# Altium schematic sheet S7CAS-PLEIADES-CARTE-MERE_P20_Passive-Components.SchDoc
size Tabloid; SheetNumber: 20; SheetTotal: 20; Sheet_Name: Insert name in Document Parameters; Size: 11x17
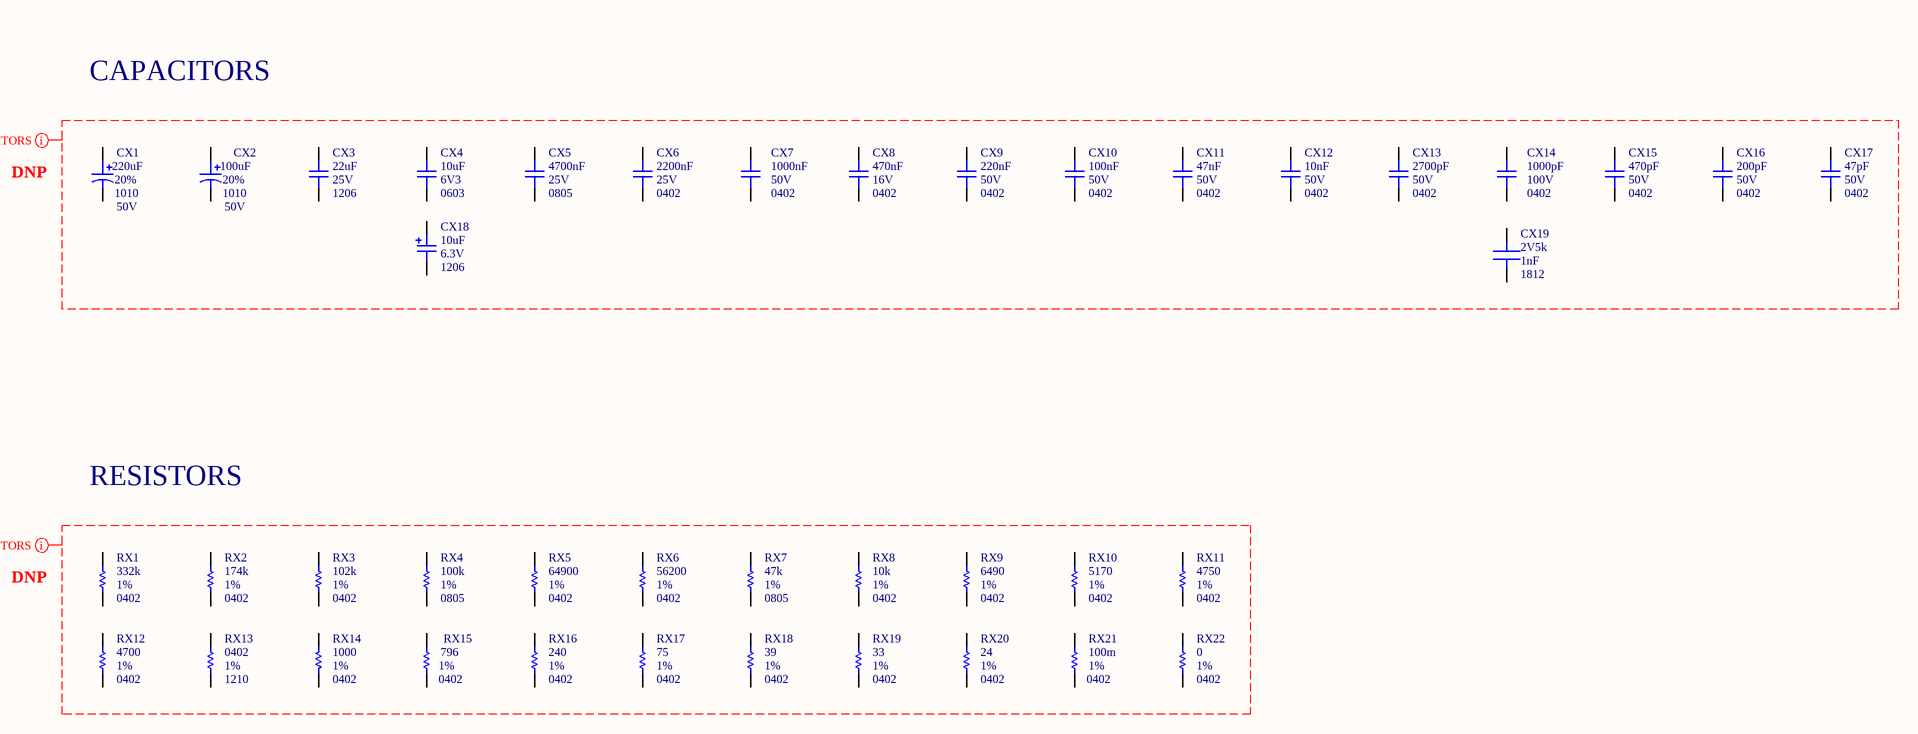
[diagram p0: S7CAS-PLEIADES-CARTE-MERE_P20_Passive-Components.SchDoc]

## Parts
CX1  value 220uF  Voltage: 50V  Package: 1010  Precision: 20%  [CAP_ALU_1010_vishay]  (hidden comment: MAL215099101E3)
CX2  value 100uF  Voltage: 50V  Package: 1010  Precision: 20%  [CAP_ALU_1010_vishay]  (hidden comment: MAL215099101E3)
CX3  value 22uF  Voltage: 25V  Package: 1206  [CAP_1206]  (hidden comment: CAP - 1206)
CX4  value 10uF  Voltage: 6V3  Package: 0603  [CAP_0603]  (hidden comment: CAP - 0603)
CX5  value 4700nF  Voltage: 25V  Package: 0805  [CAP_0805]  (hidden comment: CAP - 0805)
CX6  value 2200nF  Voltage: 25V  Package: 0402  [CAP_0402]  (hidden comment: CAP - 0402)
CX7  value 1000nF  Voltage: 50V  Package: 0402  [CAP_0402]  (hidden comment: CAP - 0402)
CX8  value 470nF  Voltage: 16V  Package: 0402  [CAP_0402]  (hidden comment: CAP - 0402)
CX9  value 220nF  Voltage: 50V  Package: 0402  [CAP_0402]  (hidden comment: CAP - 0402)
CX10  value 100nF  Voltage: 50V  Package: 0402  [CAP_0402]  (hidden comment: CAP - 0402)
CX11  value 47nF  Voltage: 50V  Package: 0402  [CAP_0402]  (hidden comment: CAP - 0402)
CX12  value 10nF  Voltage: 50V  Package: 0402  [CAP_0402]  (hidden comment: CAP - 0402)
CX13  value 2700pF  Voltage: 50V  Package: 0402  [CAP_0402]  (hidden comment: CAP - 0402)
CX14  value 1000pF  Voltage: 100V  Package: 0402  [CAP_0402]  (hidden comment: CAP - 0402)
CX15  value 470pF  Voltage: 50V  Package: 0402  [CAP_0402]  (hidden comment: CAP - 0402)
CX16  value 200pF  Voltage: 50V  Package: 0402  [CAP_0402]  (hidden comment: CAP - 0402)
CX17  value 47pF  Voltage: 50V  Package: 0402  [CAP_0402]  (hidden comment: CAP - 0402)
CX18  value 10uF  Voltage: 6.3V  Package: 1206  [CAP_TAN_1206(A)]  (hidden comment: CAP - TANTALUM - CASE A)
CX19  value 1nF  Package: 1812  Voltage Rating: 2V5k  [CAP_CER_1812]  (hidden comment: 1812WC102KAT1A)
RX1  value 332k  Package: 0402  Precision: 1%  [RES_0402]  (hidden comment: RES - 0402)
RX2  value 174k  Package: 0402  Precision: 1%  [RES_0402]  (hidden comment: RES - 0402)
RX3  value 102k  Package: 0402  Precision: 1%  [RES_0402]  (hidden comment: RES - 0402)
RX4  value 100k  Package: 0805  Precision: 1%  [RES_0805]  (hidden comment: RES - 0805)
RX5  value 64900  Package: 0402  Precision: 1%  [RES_0402]  (hidden comment: RES - 0402)
RX6  value 56200  Package: 0402  Precision: 1%  [RES_0402]  (hidden comment: RES - 0402)
RX7  value 47k  Package: 0805  Precision: 1%  [RES_0402]  (hidden comment: RES - 0402)
RX8  value 10k  Package: 0402  Precision: 1%  [RES_0402]  (hidden comment: RES - 0402)
RX9  value 6490  Package: 0402  Precision: 1%  [RES_0402]  (hidden comment: RES - 0402)
RX10  value 5170  Package: 0402  Precision: 1%  [RES_0402]  (hidden comment: RES - 0402)
RX11  value 4750  Package: 0402  Precision: 1%  [RES_0402]  (hidden comment: RES - 0402)
RX12  value 4700  Package: 0402  Precision: 1%  [RES_0402]  (hidden comment: RES - 0402)
RX13  value 1210  Package: 0402  Precision: 1%  [RES_0402]  (hidden comment: RES - 0402)
RX14  value 1000  Package: 0402  Precision: 1%  [RES_0402]  (hidden comment: RES - 0402)
RX15  value 796  Package: 0402  Precision: 1%  [RES_0402]  (hidden comment: RES - 0402)
RX16  value 240  Package: 0402  Precision: 1%  [RES_0402]  (hidden comment: RES - 0402)
RX17  value 75  Package: 0402  Precision: 1%  [RES_0402]  (hidden comment: RES - 0402)
RX18  value 39  Package: 0402  Precision: 1%  [RES_0402]  (hidden comment: RES - 0402)
RX19  value 33  Package: 0402  Precision: 1%  [RES_0402]  (hidden comment: RES - 0402)
RX20  value 24  Package: 0402  Precision: 1%  [RES_0402]  (hidden comment: RES - 0402)
RX21  value 100m  Package: 0402  Precision: 1%  [RES_0402]  (hidden comment: RES - 0402)
RX22  value 0  Package: 0402  Precision: 1%  [RES_0402]  (hidden comment: RES - 0402)

## Nets

Not connected (* = marked no-connect by the designer): CX1 1 2; CX2 1 2; CX3 1 2; CX4 1 2; CX5 1 2; CX6 1 2; CX7 1 2; CX8 1 2; CX9 1 2; CX10 1 2; CX11 1 2; CX12 1 2; CX13 1 2; CX14 1 2; CX15 1 2; CX16 1 2; CX17 1 2; CX18 1 2; CX19 1 2; RX1 1 2; RX2 1 2; RX3 1 2; RX4 1 2; RX5 1 2; RX6 1 2; RX7 1 2; RX8 1 2; RX9 1 2; RX10 1 2; RX11 1 2; RX12 1 2; RX13 1 2; RX14 1 2; RX15 1 2; RX16 1 2; RX17 1 2; RX18 1 2; RX19 1 2; RX20 1 2; RX21 1 2; RX22 1 2

## Layout directives
CompClassName: DNP: (no net found under the mark)

## Notes on the sheet
- CAPACITORS
- DNP
- RESISTORS
- Sheet Name
- Project Title
- Global Project
- Size
- Group
- Revision
- Date
- Sheet
- of
- Filename
- Designers

## Library data of the parts
CX1 CX2 = CAP_ALU_MAL215099101E3: CAP - ALU 100uF 20% 50V - 1010; Current: 490mA; Mfg: Vishay Dale; Mfg Part Number: MAL215099101E3; HelpURL: http://www.vishay.com/docs/28395/150crz.pdf; CreatedBy: Jonathan Bouchard; Temperature: -55°C to 125°C; Power: *; Supplier 1: Digikey; Supplier Part Number 1: 4399PHDKR-ND
CX3 = CAP - 1206: Mfg Part Number: GRM31CC81E226KE11; Precision: 10%; Current: *; HelpURL: https://search.murata.co.jp/Ceramy/image/img/A01X/G101/ENG/GRM31CD71H106KE11-01A.pdf; CreatedBy: Jonathan Bouchard; Power: *
CX4 = CAP - 0603: Mfg Part Number: GRM185R60J106ME15; Precision: 20%; Current: *; CreatedBy: Jonathan Bouchard; Power: *
CX5 = CAP - 0805: Mfg Part Number: GRM219R61E475KA73; Precision: 10%; Current: *; CreatedBy: Jonathan Bouchard; Power: *
CX6 = CAP - 0402: Mfg Part Number: GRM155R61E225KE11; Precision: 10%; Current: *; CreatedBy: Jonathan Bouchard; Power: *
CX7 = CAP - 0402: Mfg Part Number: GXT155R61E105KE01; Precision: 10%; Current: *; CreatedBy: Jonathan Bouchard; Power: *
CX8 = CAP - 0402: Mfg Part Number: GXT155R61C474KE01; Precision: 10%; Current: *; CreatedBy: Jonathan Bouchard; Power: *
CX9 = CAP - 0402: Mfg Part Number: GRM155R61H224KE01; Precision: 10%; Current: *; CreatedBy: Jonathan Bouchard; Power: *
CX10 = CAP - 0402: Mfg Part Number: GRM155R61H104KE14; Precision: 10%; Current: *; CreatedBy: Jonathan Bouchard; Power: *
CX11 = CAP - 0402: Mfg Part Number: GRM155R61H473KE14; Precision: 10%; Current: *; CreatedBy: Jonathan Bouchard; Power: *
CX12 = CAP - 0402: Mfg Part Number: GCM155R71H103KA55; Precision: 10%; Current: *; CreatedBy: Jonathan Bouchard; Power: *
CX13 = CAP - 0402: Mfg Part Number: GRT155R71H272KE01; Precision: 10%; Current: *; CreatedBy: Jonathan Bouchard; Power: *
CX14 = CAP - 0402: Mfg Part Number: GRM155R72A102KA01; Precision: 10%; Current: *; CreatedBy: Jonathan Bouchard; Power: *
CX15 = CAP - 0402: Mfg Part Number: GRM1555C1H471GA01; Precision: 2%; Current: *; HelpURL: https://search.murata.co.jp/Ceramy/image/img/A01X/G101/ENG/GRM1555C1H471GA01-01.pdf; CreatedBy: Jonathan Bouchard; Power: *
CX16 = CAP - 0402: Mfg Part Number: GCM1555G1H201GA16; Precision: 10%; Current: *; CreatedBy: Jonathan Bouchard; Power: *
CX17 = CAP - 0402: Mfg Part Number: GRM1555C1H470GA01; Precision: 10%; Current: *; CreatedBy: Jonathan Bouchard; Power: *
CX18 = CAP_TANT_1206(A): CAP - TANTALUM - 1206; Mfg Part Number: TBD; Precision: 10%; Current: *; HelpURL: TBD; CreatedBy: Jonathan Bouchard; Power: *
CX19 = CAP_CER_1812WC102KAT1A: CAP - CER 1000PF 2.5KV X7R - 1812; Tolerance: 10%; GRAMS Lib Spec: 2.7; Temperature: -55 to 125C; Mfg Part Number: 1812WC102KAT1A
RX1 = RES - 0402: Mfg Part Number: RK73H1FTTBL3323F; Voltage: 50V; Power: 1/32W; Current: *; CreatedBy: Jonathan Bouchard
RX2 = RES - 0402: Mfg Part Number: CRCW0402174KFKEDC; Voltage: 50V; Power: 1/16W; Current: *; CreatedBy: Jonathan Bouchard
RX3 = RES - 0402: Mfg Part Number: RMCF0402FT102K; Voltage: 50V; Power: 1/16W; Current: *; CreatedBy: Jonathan Bouchard
RX4 = RES - 0805: Mfg Part Number: CRM0805-FX-1003ELF; Current: *; CreatedBy: Jonathan Bouchard
RX5 = RES - 0402: Mfg Part Number: RMCF0402FT64K9; Voltage: 50V; Power: 1/16W; Current: *; CreatedBy: Jonathan Bouchard
RX6 = RES - 0402: Voltage: 50V; Mfg: RS73F1ERTTP5622F; Power: 1/8W; Current: *; CreatedBy: Jonathan Bouchard
RX7 = RES - 0402: Mfg Part Number: CRCW080547K0FKECHP; Voltage: 50V; Power: 1/2W; Current: *; CreatedBy: Jonathan Bouchard
RX8 = RES - 0402: Mfg Part Number: MCS04020C1002FE000; Voltage: 50V; Power: 1/2W; Current: *; CreatedBy: Jonathan Bouchard
RX9 = RES - 0402: Mfg Part Number: CRCW04026K49FKEDC; Voltage: 50V; Power: 1/16W; Current: *; CreatedBy: Jonathan Bouchard
RX10 = RES - 0402: Mfg Part Number: RN73H1ETTP5171F50; Voltage: 50V; Power: 1/16W; Current: *; CreatedBy: Jonathan Bouchard
RX11 = RES - 0402: Mfg Part Number: CR0402-FX-4751GLF; Voltage: 50V; Power: 1/16W; Current: *; CreatedBy: Jonathan Bouchard
RX12 = RES - 0402: Mfg Part Number: TBD; Voltage: 50V; Power: 1/16W; Current: *; CreatedBy: Jonathan Bouchard
RX13 = RES - 0402: Mfg Part Number: CRCW04021K21FKEDC; Voltage: 50V; Power: 1/16W; Current: *; CreatedBy: Jonathan Bouchard
RX14 = RES - 0402: Mfg Part Number: MCS04020C1001FE000; Voltage: 50V; Power: 1/16W; Current: *; CreatedBy: Jonathan Bouchard
RX15 = RES - 0402: Mfg Part Number: RN73H1ETTP7960F50; Voltage: 50V; Power: 1/16W; Current: *; CreatedBy: Jonathan Bouchard
RX16 = RES - 0402: Mfg Part Number: ERA-2AEB241X; Voltage: 50V; Power: 1/2W; Current: *; CreatedBy: Jonathan Bouchard
RX17 = RES - 0402: Mfg Part Number: SG73P; Voltage: 50V; Power: 1/16W; Current: *; CreatedBy: Jonathan Bouchard
RX18 = RES - 0402: Mfg Part Number: RL0510S-390-F; Voltage: 50; Power: 1/16W; Current: *; CreatedBy: Jonathan Bouchard
RX19 = RES - 0402: Mfg Part Number: CRCW040233R0FKEDC; Voltage: 50V; Power: 1/16W; Current: *; CreatedBy: Jonathan Bouchard
RX20 = RES - 0402: Mfg Part Number: MCS04020C2409FE000; Voltage: 50V; Power: 1/16W; Current: *; CreatedBy: Jonathan Bouchard
RX21 = RES - 0402: Mfg Part Number: ERJ-2BWFR100X; Voltage: 50V; Power: 1/2W; Current: *; CreatedBy: Jonathan Bouchard
RX22 = RES - 0402: Mfg Part Number: CR200000F; Voltage: 50V; Power: 1/16W; Current: *; CreatedBy: Jonathan Bouchard